# Altium schematic sheet sch.SchDoc: ENTER SHEET TITLE
size B; Engineer: ENTER ENGINEER NAME; Organization: CUAir; Address1: L3, 12a Rodborough Rd; Address2: Frenchs Forest; Address3: NSW; Address4: Australia 2086; Revision: ENTER REVISION NUMBER; SheetNumber: 1; SheetTotal: 1; CompetitionYear: 2019; CPN: ENTER CPN; PROJECT: ENTER PROJECT NAME
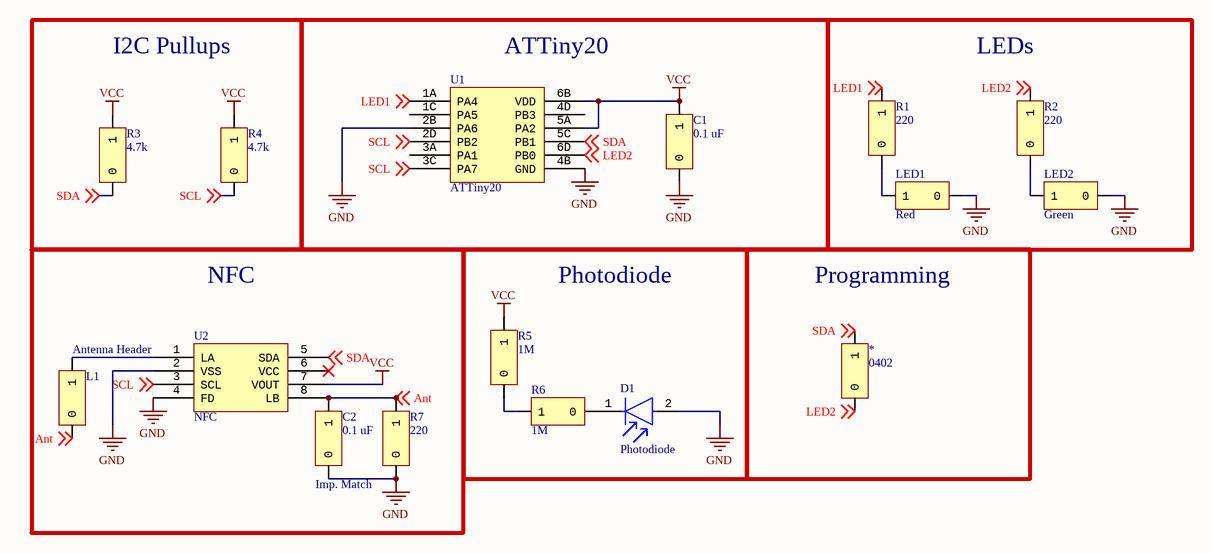
[diagram p0: sch.SchDoc]

## Parts
*  0402  [0402]
C1  0.1 uF  [01005]
C2  0.1 uF  [01005]
D1  Photodiode  [FP-6_541-5064_01-4-MFG]
L1  Antenna Header  [0402]
LED1  Red  [0201]
LED2  Green  [0201]
R1  220  [01005]
R2  220  [01005]
R3  4.7k  [01005]
R4  4.7k  [01005]
R5  1M  [01005]
R6  1M  [01005]
R7  220  [01005]
U1  ATTiny20  [ATTINY10]
U2  NFC  [NFC]

## Blocks framed on the sheet
I2C Pullups: R3 R4
ATTiny20: C1 U1
LEDs: LED1 LED2 R1 R2
NFC: C2 L1 R7 U2
Photodiode: D1 R5 R6
Programming: *

## Nets
GND: C1.0 C2.0 D1.2(A) LED1.0 LED2.0 R7.0 U1.2B(PA6) U1.4B(GND) U2.2(VSS) U2.4(FD)
VCC: C1.1 R3.1 R4.1 R5.1 U1.5A(PA2) U1.6B(VDD) U2.7(VOUT)
Ant: C2.1 L1.0 R7.1 U2.8(LB) ; off-sheet Ant
LED1: R1.1 U1.1A(PA4) ; off-sheet LED1
LED2: *.0 R2.1 U1.6D(PB0) ; off-sheet LED2
SCL: R4.0 U1.2D(PB2) U1.3C(PA7) U2.3(SCL) ; off-sheet SCL
SDA: *.1 R3.0 U1.5C(PB1) U2.5(SDA) ; off-sheet SDA
NetD1_1: D1.1(C) R6.0
NetL1_1: L1.1 U2.1(LA)
NetLED1_1: LED1.1 R1.0
NetLED2_1: LED2.1 R2.0
NetR5_0: R5.0 R6.1

Not connected (* = marked no-connect by the designer): U1 1C(PA5) 3A(PA1) 4D(PB3); U2 6(VCC)*

## Notes on the sheet
- (near C2) Imp. Match
- Project
- Title
- Size:
- Date:
- B
- Number:
- Revision:
- File:

## Library data of the parts
* L1 = 0402: 0402 Component; MPN: *; Value: *
C1 C2 = 01005: 01005 Component; MPN: CL02A104KQ2NNNC; Value: 0.1 uF
D1 = CMP-02531-000004-1: 0805 PHOTODIODE / temd7000x01; Manufacturer: Vishay; MPN: TEMD6200FX01; Viewing Angle: 120°; Dark Current: 0.0001uA; Automotive Grade: Grade 3; Max Junction Temp: +100°C; Reverse Breakdown Voltage: 16V; Power Dissipation: 100mW; Device Class L3: Photodiodes; ComponentLink2URL: http://www.vishay.com/docs/81812/temd6200.pdf; Sensor Output: Photodiode; Mouser Description: Ambient Light Sensors 16V 100mW 60Deg AEC-Q101 Qualified; Temperature: -40°C to +100°C; Temperature Range Low: -40°C; Device Class L2: Optical Sensors; ComponentLink2Description: Datasheet; Ambient Temperature Range Low: -40°C; Package: 6.541-5064.01-4; Device Class L1: Sensors; Octopart: https://octopart.com/temd6200fx01-vishay-19158932; Ambient Temperature Range High: +100°C; Category: Diode; Height: 0.95mm; Digikey Description: SENSOR PHOTODIODE 540NM 0805; Lead Free: Yes; RoHS: TRUE; Automotive: Yes; Temperature Range High: +100°C
LED1 = 0201: 0201 Component / XZMDR155W; MPN: XZMDR155W; Value: Red
LED2 = 0201: 0201 Component / XZBGR155W5MAV; MPN: XZBGR155W5MAV; Value: Green
R1 R2 R7 = 01005: 01005 Component / CRCW0100220RFREL; MPN: CRCW0100220RFREL; Value: 220
R3 R4 = 01005: 01005 Component; MPN: CL02A104KQ2NNNC; Value: 0.1 uF
R5 R6 = 01005: 01005 Component / CRCW01001M00FREL; MPN: CRCW01001M00FREL; Value: 1M